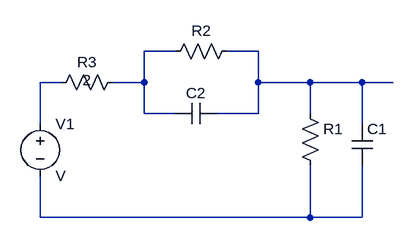
[diagram p0: schematic Y22.asc]
Y22.asc, the LTspice schematic file:
Version 4
SHEET 1 880 680
WIRE 176 112 128 112
WIRE 304 112 256 112
WIRE 0 160 -32 160
WIRE 128 160 128 112
WIRE 128 160 80 160
WIRE 304 160 304 112
WIRE 384 160 304 160
WIRE 464 160 384 160
WIRE 512 160 464 160
WIRE 128 208 128 160
WIRE 176 208 128 208
WIRE 304 208 304 160
WIRE 304 208 240 208
WIRE 384 208 384 160
WIRE -32 224 -32 160
WIRE 464 224 464 160
WIRE -32 368 -32 304
WIRE 384 368 384 288
WIRE 384 368 -32 368
WIRE 464 368 464 288
WIRE 464 368 384 368
SYMBOL res 272 96 R90
WINDOW 0 0 56 VBottom 2
WINDOW 3 32 56 VTop 2
SYMATTR InstName R2
SYMATTR Value ""
SYMBOL cap 240 192 R90
WINDOW 0 0 32 VBottom 2
WINDOW 3 32 32 VTop 2
SYMATTR InstName C2
SYMATTR Value ""
SYMBOL res 96 144 R90
WINDOW 0 0 56 VBottom 2
WINDOW 3 28 56 VBottom 2
SYMATTR InstName R3
SYMATTR Value 2
SYMBOL cap 448 224 R0
SYMATTR InstName C1
SYMATTR Value ""
SYMBOL res 368 192 R0
SYMATTR InstName R1
SYMATTR Value ""
SYMBOL voltage -32 208 R0
SYMATTR InstName V1

The netlist it stands for:
* Y22.asc
R2 N002 N001
C2 N002 N001
R3 N001 N003 2
C1 N002 N004
R1 N002 N004
V1 N003 N004 V
.backanno
.end